# EAGLE design VehicleBattVMonIoT_SMD (EAGLE 7.5.0)
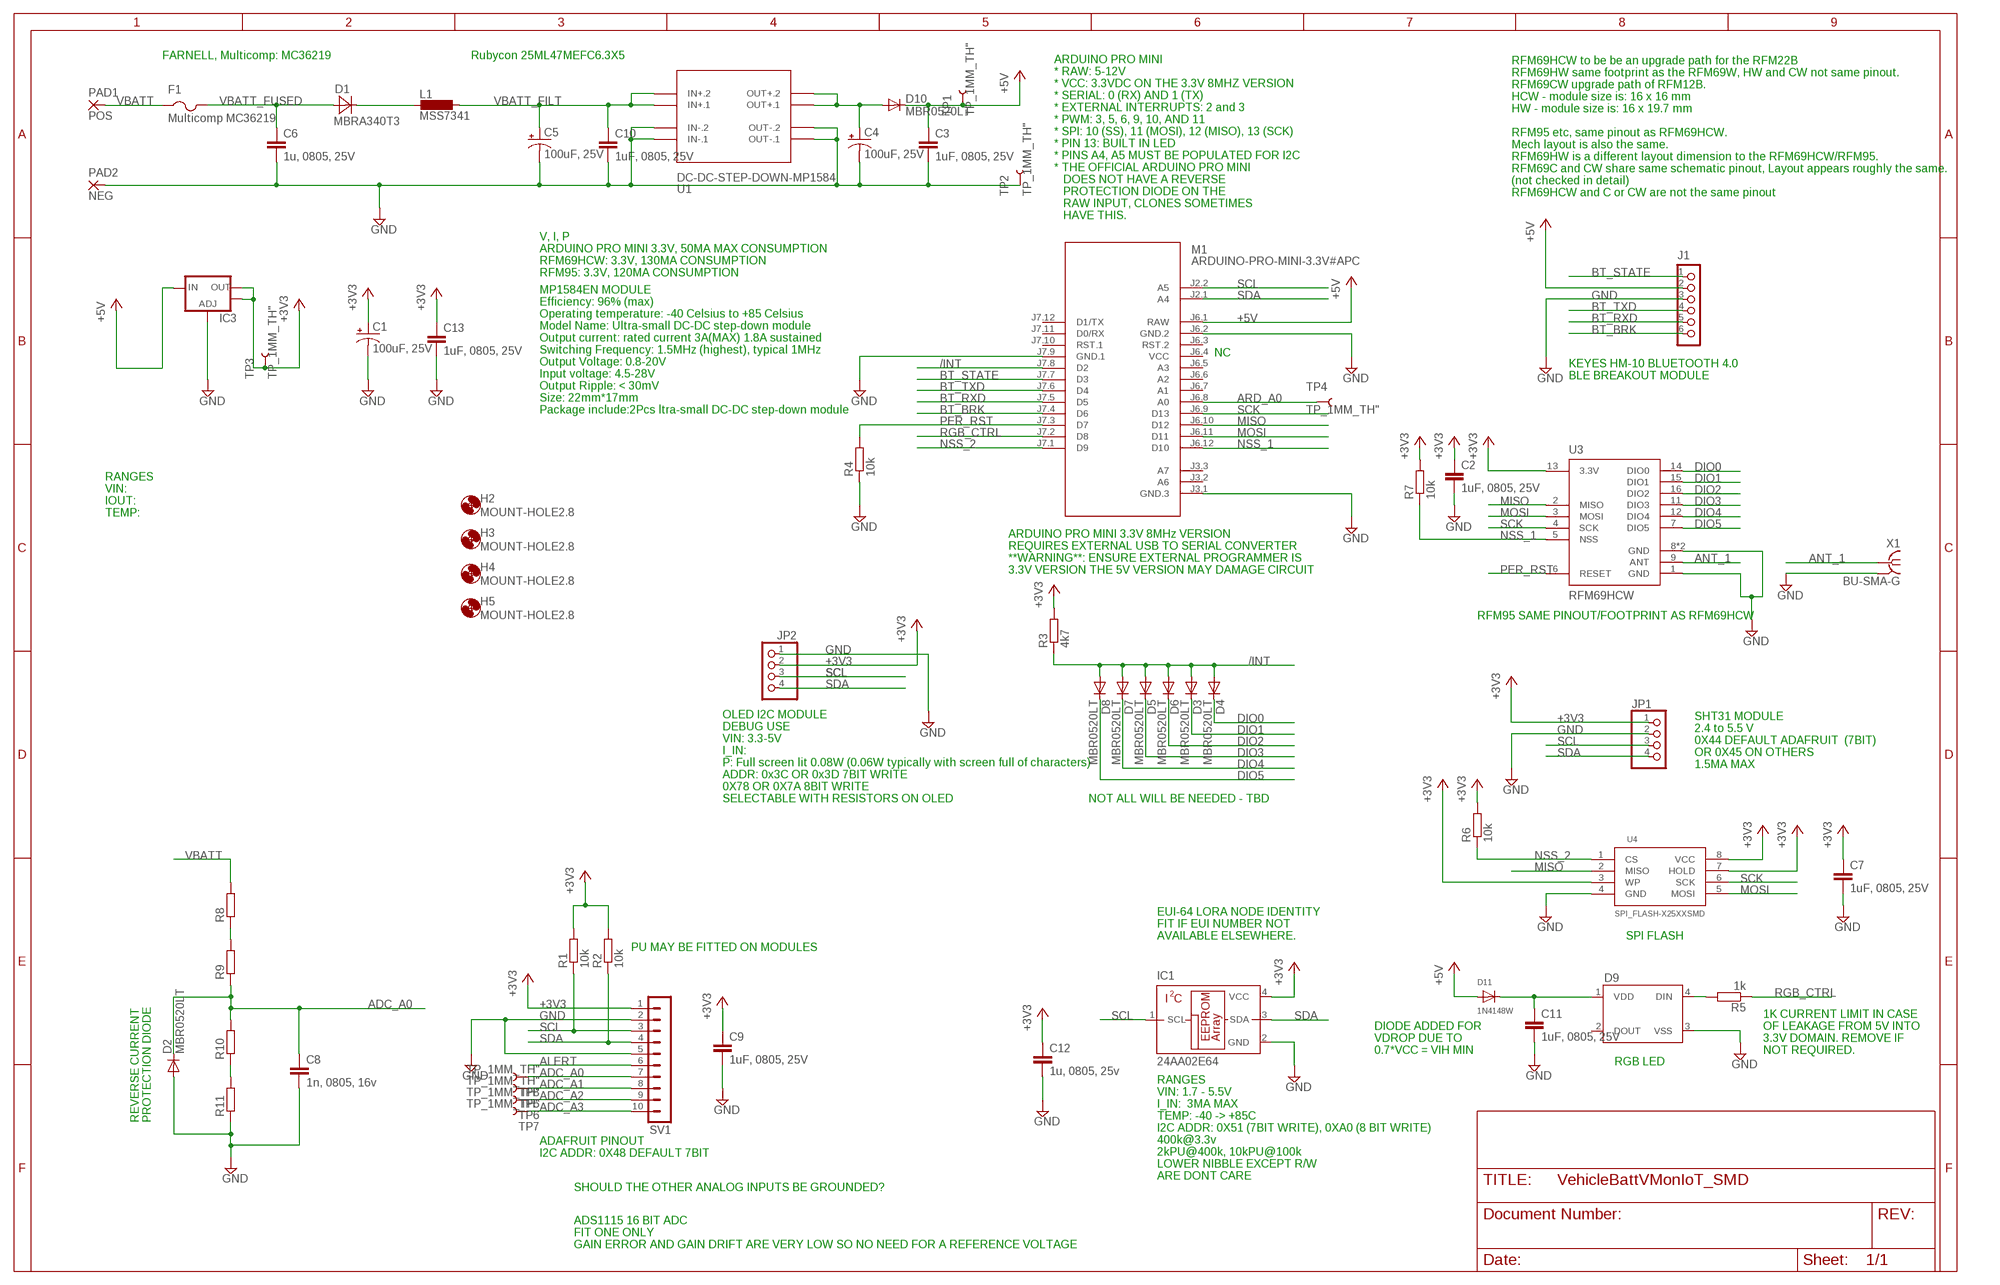
[diagram p0: schematic, sheet 1]

## Parts
C1  100uF, 25V  CAP_POLPTH1  [CPOL-RADIAL-100UF-25V]
C2  1uF, 0805, 25V  C-EUC0805  [C0805]
C3  1uF, 0805, 25V  C-EUC0805  [C0805]
C4  100uF, 25V  CAP_POLPTH1  [CPOL-RADIAL-100UF-25V]
C5  100uF, 25V  CAP_POLPTH1  [CPOL-RADIAL-100UF-25V]
C6  1u, 0805, 25V  C-EUC0805  [C0805]
C7  1uF, 0805, 25V  C-EUC0805  [C0805]
C8  1n, 0805, 16v  C-EUC0805  [C0805]
C9  1uF, 0805, 25V  C-EUC0805  [C0805]
C10  1uF, 0805, 25V  C-EUC0805  [C0805]
C11  1uF, 0805, 25V  C-EUC0805  [C0805]
C12  1u, 0805, 25v  C-EUC0805  [C0805]
C13  1uF, 0805, 25V  C-EUC0805  [C0805]
D1  MBRA340T3  [SMA]
D2  MBR0520LT  [SOD123]
D3  MBR0520LT  [SOD123]
D4  MBR0520LT  [SOD123]
D5  MBR0520LT  [SOD123]
D6  MBR0520LT  [SOD123]
D7  MBR0520LT  [SOD123]
D8  MBR0520LT  [SOD123]
D9  WS2812B  [WS2812B]
D10  MBR0520LT  [SOD123]
D11  1N4148W  DIODESOD-323F  [SOD-323F]
F1  Multicomp MC36219  PTCFUSE-1812  [1812]
H2  MOUNT-HOLE2.8  [2,8]
H3  MOUNT-HOLE2.8  [2,8]
H4  MOUNT-HOLE2.8  [2,8]
H5  MOUNT-HOLE2.8  [2,8]
IC1  24AA02E64  24AA00OT  [SOT23-5L]
IC3  V_REG_LM1117SOT223  [SOT223]
J1  CON_HEADER_1X06-SMD-RIGHT-ANGLED  [M1X6_MALE_RIGHT_ANGLED_SMD]
JP1  PINHD-1X4  [1X04]
JP2  PINHD-1X4  [1X04]
L1  MSS7341  [MSS7341]
M1  ARDUINO-PRO-MINI-3.3V#APC  [ARDUINO-PRO-MINI#APC]
PAD1  POS  3,81/1,4  [3,81/1,4]
PAD2  NEG  3,81/1,4  [3,81/1,4]
R1  10k  R-EU_R0805  [R0805]
R2  10k  R-EU_R0805  [R0805]
R3  4k7  R-EU_R0805  [R0805]
R4  10k  R-EU_R0805  [R0805]
R5  1k  R-EU_R0805  [R0805]
R6  10k  R-EU_R0805  [R0805]
R7  10k  R-EU_R0805  [R0805]
R8  R-EU_R0805  [R0805]
R9  R-EU_R0805  [R0805]
R10  R-EU_R0805  [R0805]
R11  R-EU_R0805  [R0805]
SV1  MA10-1W  [MA10-1W]
TP1  TP_1MM_TH"  [TP_1MM_TH]
TP2  TP_1MM_TH"  [TP_1MM_TH]
TP3  TP_1MM_TH"  [TP_1MM_TH]
TP4  TP_1MM_TH"  [TP_1MM_TH]
TP5  TP_1MM_TH"  [TP_1MM_TH]
TP6  TP_1MM_TH"  [TP_1MM_TH]
TP7  TP_1MM_TH"  [TP_1MM_TH]
TP8  TP_1MM_TH"  [TP_1MM_TH]
U1  DC-DC-STEP-DOWN-MP1584  [DC-DC-STEP-DOWN-MP1584]
U3  RFM69HCW  [RFM69HCW-XXXS2]
U4  SPI_FLASH-X25XXSMD  [SO08]
X1  BU-SMA-G  [BU-SMA-G]

## Nets
+3V3: C1.1(+) C2.1 C7.1 C9.1 C12.1 C13.1 IC1.4(VCC) IC3.2(OUT) IC3.4(OUT) JP1.1 JP2.2 R1.2 R2.2 R3.2 R6.2 R7.2 SV1.1 TP3.P$1 U3.13(3.3V) U4.3(WP) U4.7(HOLD) U4.8(VCC)
+5V: C3.1 D10.C D11.A IC3.3(IN) J1.2 M1.J6.1(RAW) TP1.P$1
/INT: D3.A D4.A D5.A D6.A D7.A D8.A M1.J7.8(D2) R3.1
ADC_A0: C8.1 D2.C R9.1 R10.2 SV1.7 TP8.P$1
ADC_A1: SV1.8 TP5.P$1
ADC_A2: SV1.9 TP6.P$1
ADC_A3: SV1.10 TP7.P$1
ALERT: SV1.6
ANT_1: U3.9(ANT) X1.1
ARD_A0: M1.J6.8(A0) TP4.P$1
BT_BRK: J1.6 M1.J7.4(D6)
BT_RXD: J1.5 M1.J7.5(D5)
BT_STATE: J1.1 M1.J7.7(D3)
BT_TXD: J1.4 M1.J7.6(D4)
DIO0: D4.C U3.14(DIO0)
DIO1: D3.C U3.15(DIO1)
DIO2: D6.C U3.16(DIO2)
DIO3: D5.C U3.11(DIO3)
DIO4: D7.C U3.12(DIO4)
DIO5: D8.C U3.7(DIO5)
GND: C1.2(-) C2.2 C3.2 C4.2(-) C5.2(-) C6.2 C7.2 C8.2 C9.2 C10.2 C11.2 C12.2 C13.2 D2.A D9.3(VSS) IC1.2(GND) IC3.1(ADJ) J1.3 JP1.2 JP2.1 M1.J3.1(GND.3) M1.J6.2(GND.2) M1.J7.9(GND.1) PAD2.1(P) R4.1 R11.1 SV1.2 SV1.5 TP2.P$1 U1.IN-.1 U1.IN-.2 U1.OUT-.1 U1.OUT-.2 U3.1(GND) U3.8(GND) U3.10(GND) U4.4(GND) X1.2 X1.3 X1.4 X1.5
MISO: M1.J6.10(D12) U3.2(MISO) U4.2(MISO)
MOSI: M1.J6.11(D11) U3.3(MOSI) U4.5(MOSI)
N$1: C11.1 D9.1(VDD) D11.C
N$2: D1.C L1.1
N$3: R10.1 R11.2
N$4: R8.1 R9.2
N$5: C4.1(+) D10.A U1.OUT+.1 U1.OUT+.2
N$6: D9.4(DIN) R5.2
NSS_1: M1.J6.12(D10) R7.1 U3.5(NSS)
NSS_2: M1.J7.1(D9) R6.1 U4.1(CS)
PER_RST: M1.J7.3(D7) R4.2 U3.6(RESET)
RGB_CTRL: M1.J7.2(D8) R5.1
SCK: M1.J6.9(D13) U3.4(SCK) U4.6(SCK)
SCL: IC1.1(SCL) JP1.3 JP2.3 M1.J2.2(A5) R1.1 SV1.3
SDA: IC1.3(SDA) JP1.4 JP2.4 M1.J2.1(A4) R2.1 SV1.4
VBATT: F1.1 PAD1.1(P) R8.2
VBATT_FILT: C5.1(+) C10.1 L1.2 U1.IN+.1 U1.IN+.2
VBATT_FUSED: C6.1 D1.A F1.2
Unconnected: D9.2(DOUT) M1.J3.2(A6) M1.J3.3(A7) M1.J6.3(RST.2) M1.J6.5(A3) M1.J6.6(A2) M1.J6.7(A1) M1.J7.10(RST.1) M1.J7.11(D0/RX) M1.J7.12(D1/TX)

## Notes on the sheet
- FARNELL, Multicomp: MC36219 | Rubycon 25ML47MEFC6.3X5
- RFM69HCW to be be an upgrade path for the RFM22B
  RFM69HW same footprint as the RFM69W, HW and CW not same pinout.
  RFM69CW upgrade path of RFM12B. 
  HCW - module size is: 16 x 16 mm 
  HW - module size is: 16 x 19.7 mm
  
  RFM95 etc, same pinout as RFM69HCW.
  Mech layout is also the same. 
  RFM69HW is a different layout dimension to the RFM69HCW/RFM95. 
  RFM69C and CW share same schematic pinout, Layout appears roughly the same. 
  (not checked in detail)
  RFM69HCW and C or CW are not the same pinout
- ARDUINO PRO MINI 
  * RAW: 5-12V
  * VCC: 3.3VDC ON THE 3.3V 8MHZ VERSION
  * SERIAL: 0 (RX) AND 1 (TX)
  * EXTERNAL INTERRUPTS: 2 and 3
  * PWM: 3, 5, 6, 9, 10, AND 11
  * SPI: 10 (SS), 11 (MOSI), 12 (MISO), 13 (SCK)
  * PIN 13: BUILT IN LED
  * PINS A4, A5 MUST BE POPULATED FOR I2C
  * THE OFFICIAL ARDUINO PRO MINI 
     DOES NOT HAVE A REVERSE
     PROTECTION DIODE ON THE 
     RAW INPUT, CLONES SOMETIMES 
     HAVE THIS.
- V, I, P
  ARDUINO PRO MINI 3.3V, 50MA MAX CONSUMPTION
  RFM69HCW: 3.3V, 130MA CONSUMPTION
  RFM95: 3.3V, 120MA CONSUMPTION
- NC
- KEYES HM-10 BLUETOOTH 4.0 
  BLE BREAKOUT MODULE
- MP1584EN MODULE
  Efficiency: 96% (max)
  Operating temperature: -40 Celsius to +85 Celsius
  Model Name: Ultra-small DC-DC step-down module
  Output current: rated current 3A(MAX) 1.8A sustained
  Switching Frequency: 1.5MHz (highest), typical 1MHz
  Output Voltage: 0.8-20V 
  Input voltage: 4.5-28V
  Output Ripple: < 30mV
  Size: 22mm*17mm
  Package include:2Pcs ltra-small DC-DC step-down module
- RANGES
  VIN: 
  IOUT:  
  TEMP:
- ARDUINO PRO MINI 3.3V 8MHz VERSION
  REQUIRES EXTERNAL USB TO SERIAL CONVERTER
  **WARNING**: ENSURE EXTERNAL PROGRAMMER IS 
  3.3V VERSION THE 5V VERSION MAY DAMAGE CIRCUIT
- RFM95 SAME PINOUT/FOOTPRINT AS RFM69HCW
- SHT31 MODULE
  2.4 to 5.5 V
  0X44 DEFAULT ADAFRUIT  (7BIT)
  OR 0X45 ON OTHERS
  1.5MA MAX
- OLED I2C MODULE
  DEBUG USE
  VIN: 3.3-5V
  I_IN:
  P: Full screen lit 0.08W (0.06W typically with screen full of characters)
  ADDR: 0x3C OR 0x3D 7BIT WRITE
  0X78 OR 0X7A 8BIT WRITE
  SELECTABLE WITH RESISTORS ON OLED
- NOT ALL WILL BE NEEDED - TBD
- EUI-64 LORA NODE IDENTITY
  FIT IF EUI NUMBER NOT 
  AVAILABLE ELSEWHERE.
- SPI FLASH
- PU MAY BE FITTED ON MODULES
- DIODE ADDED FOR 
  VDROP DUE TO 
  0.7*VCC = VIH MIN
- 1K CURRENT LIMIT IN CASE 
  OF LEAKAGE FROM 5V INTO
  3.3V DOMAIN. REMOVE IF 
  NOT REQUIRED.
- RGB LED
- REVERSE CURRENT 
  PROTECTION DIODE
- ADAFRUIT PINOUT
  I2C ADDR: 0X48 DEFAULT 7BIT
- RANGES
  VIN: 1.7 - 5.5V
  I_IN:  3MA MAX
  TEMP: -40 -> +85C
  I2C ADDR: 0X51 (7BIT WRITE), 0XA0 (8 BIT WRITE) 
  400k@3.3v
  2kPU@400k, 10kPU@100k
  LOWER NIBBLE EXCEPT R/W 
  ARE DONT CARE
- SHOULD THE OTHER ANALOG INPUTS BE GROUNDED?
- ADS1115 16 BIT ADC
  FIT ONE ONLY
  GAIN ERROR AND GAIN DRIFT ARE VERY LOW SO NO NEED FOR A REFERENCE VOLTAGE

## Power pins joined to a net without a drawn wire
VCC: M1.J6.4(VCC)

## Library data of the parts
C1 C4 C5 = SparkFun-Capacitors:CAP_POL: Capacitor Polarized These are standard SMD and PTH capacitors. Normally 10uF, 47uF, and 100uF in electrolytic and tantalum varieties. Always verify the external diameter of the through hole cap, it varies with capacity, voltage, and manufacturer. The EIA devices should be standard.
C2 C3 C6-C13 = rcl:C-EU: CAPACITOR, European symbol
D1 = diode:MBRA340T3: Surface Mount Schottky Power Rectifier Source: http://www.onsemi.com/pub_link/Collateral/MBRA340T3-D.PDF
D2-D8 D10 = diode:MBR0520LT: SCHOTTKY BARRIER RECTIFIER Source: http://onsemi.com .. MBR0520LT1-D.pdf
D9 = SparkFun-LED:WS2812B: WS2812B - Intelligent control LED integrated light source Technical Specifications: Power Supply Voltage (VDD): 3.5 to 5.3 V Input Voltage (VI): -0.5 to VDD+0.5 V Operating Junction Temperature (Topt): -25°C to +80°C Storage Temperature Range (Tstg): -55°C to +150°C
D11 = adafruit:DIODE: Diode SMADIODE - SMA Surface Mount Package 20V 1A Schottky Diode Digikey: 641-1014-6-ND DO-1N4148 - Through Hole Small Current Diode SOD-123 20V 1 A (.5mV Vf) Schottky Diode - Digikey: MBRX120TPMSCT-ND SOD-323 10V 570mA (.38mV Vf, 3ns) Schottky Diode - Digikey: ZLLS410CT-ND SOD-523 30V 30mA Schottky Diode (RB751S-40TE61) - Digikey: RB751S-40TE61CT-ND SOT23-R/W - SOT23 Package (R = Solder Paste/Reflow Ovens, W = Hand-Soldering) BAT54Film 40V 300mA - Digikey: 497-7162-1-ND
F1 = adafruit:PTCFUSE: PTC fuses, resettable thermistors
H2-H5 = holes:MOUNT-HOLE: MOUNTING HOLE with drill center marker
IC1 = microchip:24*00: Serial EEPROM 128 bit, I2C (AA = 1.8 V/LC = 2.5 V/C = 5.0 V); MF: MICROCHIP; MPN: 24AA00T-I/OTG; OC_FARNELL: 1331264; OC_NEWARK: 89H3038
IC3 = SparkFun-PowerIC:V_REG_LM1117: Voltage Regulator LM1117 Standard adjustable voltage regulator but in SMD form. Spark Fun Electronics SKU : COM-00595; PROD_ID: VREG-08170
J1 = dp_devices:CON_HEADER_1X06
JP1 JP2 = pinhead:PINHD-1X4: PIN HEADER
L1 = inductor-coilcraft:MSS7341: Shielded Power Inductors Package 6.6 × 6.6 mm x 4.1 mm high Source: http://www.farnell.com/datasheets/1681958.pdf
M1 = diy-modules:ARDUINO-PRO-MINI-*#APC: Arduino Pro Mini (and compatible devices) with angle programming connector More details available here: https://www.arduino.cc/en/Main/ArduinoBoardProMini Click here to find device on ebay.com <http://www.ebay.com/sch/arduino+pro+mini>
PAD1 PAD2 = wirepad:3,81/1,4: THROUGH-HOLE PAD
R1-R11 = rcl:R-EU_: RESISTOR, European symbol
SV1 = con-lstb:MA10-1W: PIN HEADER; OC_FARNELL: unknown; OC_NEWARK: unknown
TP1-TP8 = TP_1MM_TH:TP_1MM_TH: Bare copper test points for troubleshooting or ICT
U1 = diy-modules:DC-DC-STEP-DOWN-MP1584: DC/DC Step-Down Regulator based on MP1584 chip MP1584 datasheet available here: http://www.haoyuelectronics.com/Attachment/MP1584/MP1584.pdf Click here to find device on ebay.com <http://www.ebay.com/sch/mp1584+module>
U3 = SparkFun-RF:RFM69H
U4 = SparkFun-DigitalIC:SPI_FLASH-X25XX: 8pin SPI Flash series x25xx. Works with devices like W25X32 and BR25L32
X1 = con-coax:BU-SMA-G: FEMALE SMA CONNECTOR Radiall distributor RS 193-9117; OC_FARNELL: unknown; OC_NEWARK: unknown

## Board
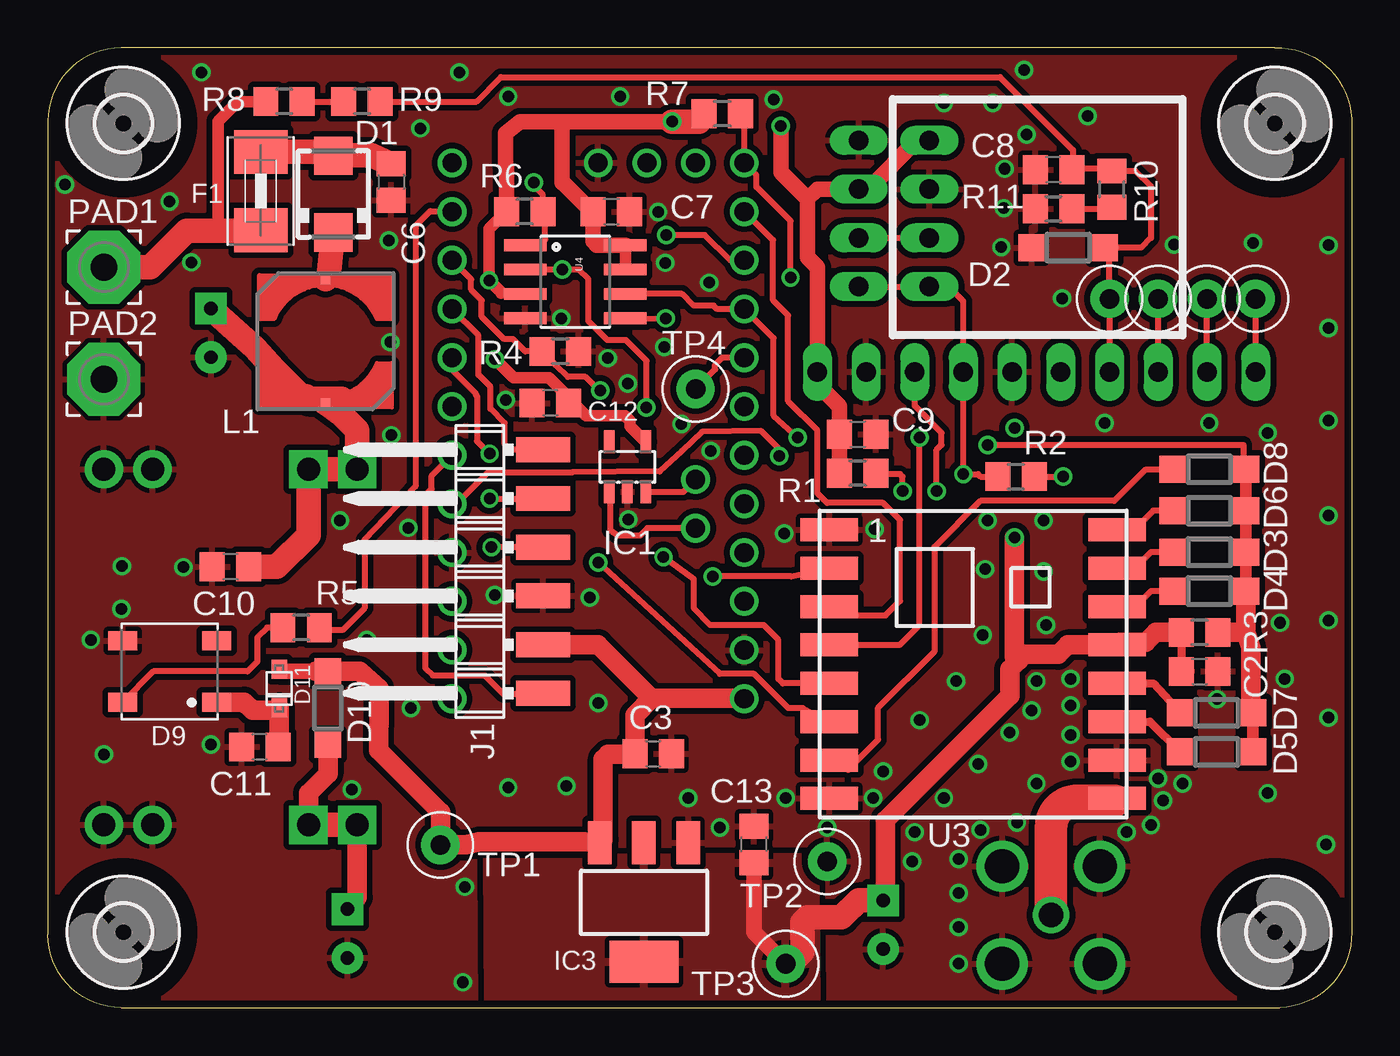
[diagram p1: board, top side]
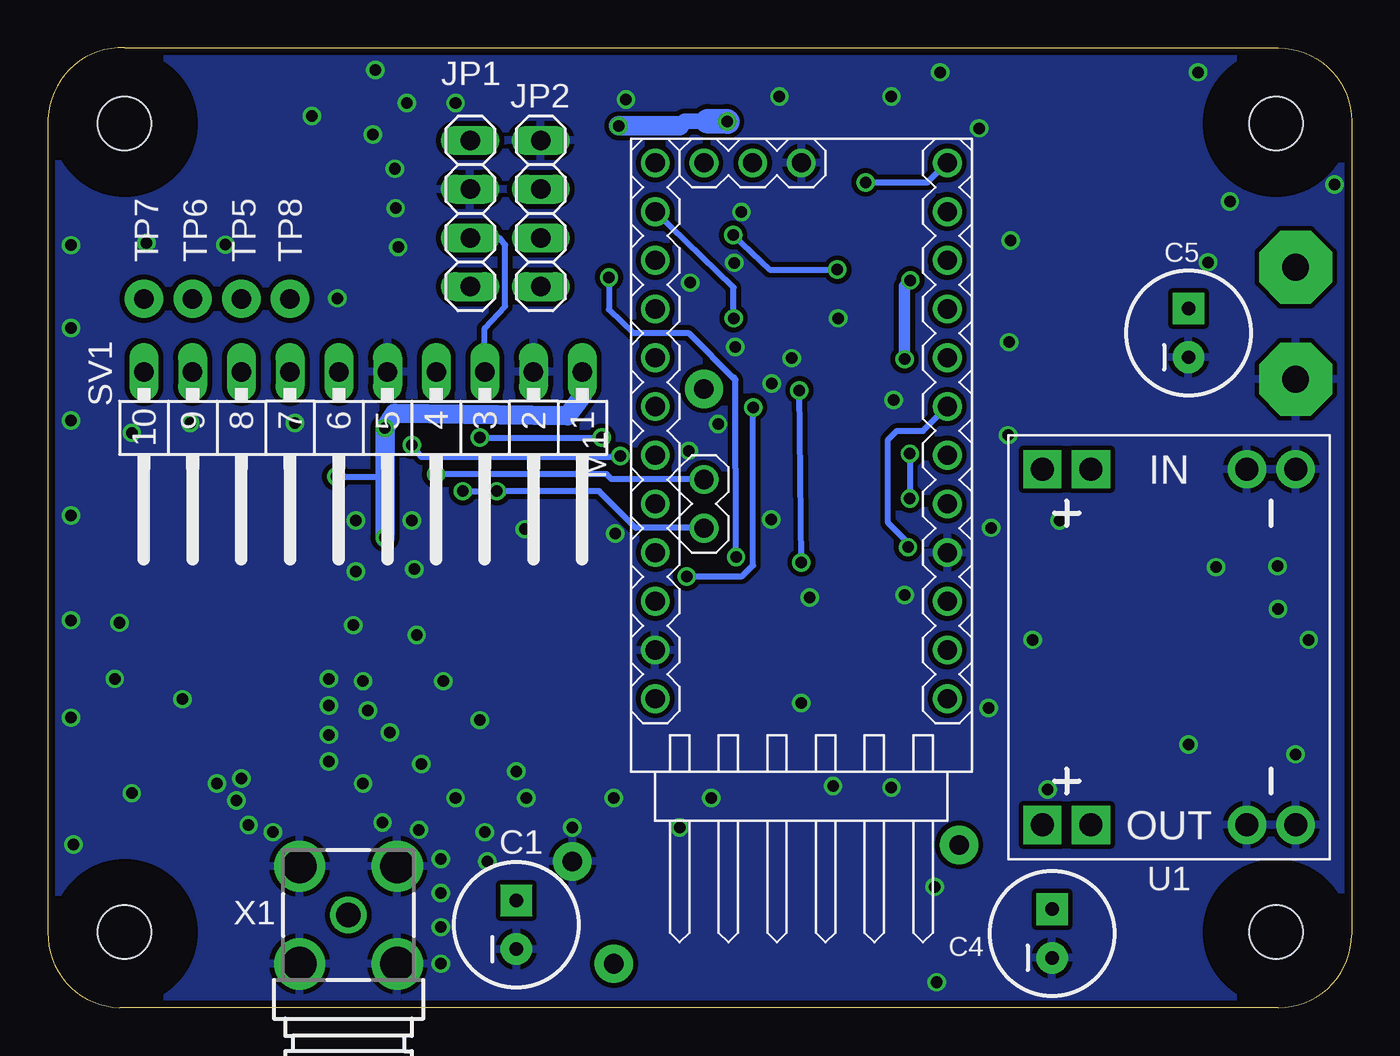
[diagram p2: board, bottom side, seen from below]

Size 68 x 50.04 mm. Coordinates in mm from the lower left corner, seen from the top.
Outline: 3.81,0 64.25,0 arc90 68,3.94 68,46.35 arc90 64,50.04 3.81,50.04 arc90 0,46.23 0,3.81 arc90 3.81,0
Copper layers (1*16): Top 0.0356mm / dielectric 1.5011mm / Bottom 0.0356mm
Design rules "oshpark-2layer": minimum track width 6mil, minimum drill 13mil, track to track 6mil, track to pad 6mil, pad to pad 6mil, via to via 6mil, smd to smd 6mil, copper to edge 15mil, drill to drill 6mil, minimum pad ring 7mil, minimum via ring 7mil, stop-mask expansion 2.5mil, vias tented up to drill 0mil, thermal gap 10mil

### Footprints (pad centres in the part's own frame; a part is rotated, then mirrored left to right if it is on the bottom)
CPOL-RADIAL-100UF-25V = drill 0.7 pad 1.651 square: 1 1.27,0 | drill 0.7 pad 1.651: 2 -1.27,0
C0805 = smd 1.3 x 1.5: 1 -0.95,0; 2 0.95,0
SMA = smd 2 x 2: A 2,0; C -2,0
SOD123 = smd 1.4 x 1.4: A 1.9,0; C -1.9,0
WS2812B = smd 1.5 x 1: 1 -2.45,1.6; 2 -2.45,-1.6; 3 2.45,-1.6; 4 2.45,1.6
SOD-323F = smd 1 x 0.8: A -1,0; C 1,0
1812 = smd 2.286 x 2.794: 1 -2.046,0; 2 2.046,0
2,8 = hole 2.8: 0,0
SOT23-5L = smd 0.55 x 1.2: 1 -0.95,-1.3; 2 0,-1.3; 3 0.95,-1.3; 4 0.95,1.3; 5 -0.95,1.3
SOT223 = smd 1.219 x 2.235: 1 -2.311,-3.099; 2 0,-3.099; 3 2.311,-3.099 | smd 3.6 x 2.2: 4 0,3.099
M1X6_MALE_RIGHT_ANGLED_SMD = smd 1.3 x 2.8: 1 -6.35,-3.3; 2 -3.81,-3.3; 3 -1.27,-3.3; 4 1.27,-3.3; 5 3.81,-3.3; 6 6.35,-3.3
1X04 = drill 1.016 long: 1 -3.81,0; 2 -1.27,0; 3 1.27,0; 4 3.81,0
MSS7341 = smd 0.5 x 0.5: 1 0,3.225; 2 0,-3.225
ARDUINO-PRO-MINI#APC = drill 1: J2.1 -1.27,5.08; J2.2 -3.81,5.08; J3.1 15.24,0; J3.2 15.24,2.54; J3.3 15.24,5.08; J6.1 -12.7,7.62; J6.2 -10.16,7.62; J6.3 -7.62,7.62; J6.4 -5.08,7.62; J6.5 -2.54,7.62; J6.6 0,7.62; J6.7 2.54,7.62; J6.8 5.08,7.62; J6.9 7.62,7.62; J6.10 10.16,7.62; J6.11 12.7,7.62; J6.12 15.24,7.62; J7.1 15.24,-7.62; J7.2 12.7,-7.62; J7.3 10.16,-7.62; J7.4 7.62,-7.62; J7.5 5.08,-7.62; J7.6 2.54,-7.62; J7.7 0,-7.62; J7.8 -2.54,-7.62; J7.9 -5.08,-7.62; J7.10 -7.62,-7.62; J7.11 -10.16,-7.62; J7.12 -12.7,-7.62
3,81/1,4 = drill 1.397 pad 3.81 octagon: 1 0,0
R0805 = smd 1.3 x 1.5: 1 -0.95,0; 2 0.95,0
MA10-1W = drill 1.016 long: 1 -11.43,0; 2 -8.89,0; 3 -6.35,0; 4 -3.81,0; 5 -1.27,0; 6 1.27,0; 7 3.81,0; 8 6.35,0; 9 8.89,0; 10 11.43,0
TP_1MM_TH = drill 1.02 pad 2: P$1 0,0
DC-DC-STEP-DOWN-MP1584 = drill 1.2 pad 2 square: IN+.1 -9.271,-4.064; IN+.2 -9.271,-6.604; OUT+.1 9.271,-4.064; OUT+.2 9.271,-6.604 | drill 1.2 pad 2: IN-.1 -9.271,6.604; IN-.2 -9.271,4.064; OUT-.1 9.271,6.604; OUT-.2 9.271,4.064
RFM69HCW-XXXS2 = smd 3 x 1.2: 1 -7.5,7; 2 -7.5,5; 3 -7.5,3; 4 -7.5,1; 5 -7.5,-1; 6 -7.5,-3; 7 -7.5,-5; 8 -7.5,-7; 9 7.5,-7; 10 7.5,-5; 11 7.5,-3; 12 7.5,-1; 13 7.5,1; 14 7.5,3; 15 7.5,5; 16 7.5,7
SO08 = smd 0.61 x 2.21: 1 -1.905,-2.616; 2 -0.635,-2.616; 3 0.635,-2.616; 4 1.905,-2.616; 5 1.905,2.616; 6 0.635,2.616; 7 -0.635,2.616; 8 -1.905,2.616
BU-SMA-G = drill 1.27: 1 0,0 | drill 1.778: 2 -2.55,2.55; 3 2.55,2.55; 4 2.55,-2.55; 5 -2.55,-2.55

### Placement (x,y rotation side)
C1  43.56,4.32 90 bottom
C2  60.07,17.53 0 top
C3  31.57,13.23 0 top
C4  15.62,3.86 90 bottom
C5  8.51,35.18 90 bottom
C6  17.91,43.05 270 top
C7  29.39,41.5 0 top
C8  52.45,43.69 180 top
C9  42.24,29.9 0 top
C10  9.53,22.99 180 top
C11  11.05,13.59 180 top
C12  26.21,31.52 180 top
C13  36.83,8.51 90 top
D1  14.88,42.42 90 top
D2  53.21,39.62 180 top
D3  60.58,23.75 0 top
D4  60.58,21.72 0 top
D5  60.96,13.34 0 top
D6  60.58,25.91 0 top
D7  60.96,15.37 0 top
D8  60.58,28.07 0 top
D9  6.35,17.53 180 top
D10  14.61,15.62 270 top
D11  12.06,16.64 270 top
F1  11.1,42.57 90 top
H2  3.94,3.94 0 top
H3  3.94,46.1 0 top
H4  64,46.1 0 top
H5  64,3.94 0 top
IC1  30.23,28.19 0 top
IC3  31.09,5.49 180 top
J1  22.53,22.73 90 top
JP1  45.97,41.4 270 bottom
JP2  42.29,41.4 270 bottom
L1  14.48,34.75 0 top
M1  28.7,28.8 90 bottom
PAD1  2.92,38.61 0 top
PAD2  2.92,32.77 0 top
R1  42.24,27.86 180 top
R2  50.5,27.69 0 top
R3  60.07,19.56 180 top
R4  26.72,34.21 180 top
R5  13.21,19.81 180 top
R6  24.87,41.5 180 top
R7  35.18,46.61 180 top
R8  12.32,47.24 180 top
R9  16.38,47.24 180 top
R10  55.5,42.67 90 top
R11  52.45,41.66 0 top
SV1  51.56,33.15 180 bottom
TP1  20.47,8.48 0 top
TP2  40.64,7.62 0 top
TP3  38.48,2.29 0 top
TP4  33.78,32.26 0 top
TP5  57.91,36.96 0 top
TP6  60.45,36.96 0 top
TP7  62.99,36.96 0 top
TP8  55.37,36.96 0 top
U1  9.53,18.8 270 bottom
U3  48.26,17.91 0 top
U4  27.51,37.85 270 top
X1  52.32,4.83 270 bottom

### Tracks (layer width: path | path; a pad name or v marks a point on that pad's centre or on a via)
+3V3  (via drill 0.6)
  Top 0.305: R2.2 v52.96,27.69 | U4.3 23.65,37.24 | 41.44,29.9 C9.1
  Top 0.406: R3.2 C2.1
  Top 0.61: U4.7 U4.8 | R6.2 23.01,40.6 v23.01,37.92 23.65,37.29 23.65,37.24 | v23.32,33.81 24.28,32.84 26.14,32.84 27.16,31.82 C12.1 27.41,31.52 28.07,30.86 30.1,30.86 30.35,30.61 30.35,30.32 IC1.4
  Top 0.813: R6.2 23.92,43.85 23.88,43.99 23.88,45.59 24.64,46.2 27.03,46.2 | U4.8 28.63,39.75 28.42,39.95 28.42,41.49 | 28.37,41.5 26.87,43 26.82,43 26.82,46 27.03,46.2 | 27.03,46.2 v32.56,46.2 | C13.1 36.83,3.94 TP3.P$1 | v38.23,45.97 38.23,43.56 39.62,42.16 | 39.62,42.16 39.62,39.12 40.13,38.61 SV1.1 40.13,32.51 41.28,31.36 41.28,30.87 41.29,30.86 C9.1 R1.2 | 39.62,42.16 40.13,42.67 JP2.2 42.8,42.67 45.34,45.21 JP1.1
  Top 1.016: C1.1 43.69,5.71 43.69,9.78 50.16,16.26 50.16,17.65 50.61,18.1 | 50.8,18.29 50.42,17.93 | 50.61,18.1 50.8,18.29 | 50.8,18.29 50.93,18.41 52.7,18.41 53.2,18.91 U3.13 55.9,19.05 57.28,19.05 57.78,19.56 R3.2 | 28.42,41.49 C7.1 28.37,41.5 | v50.42,24.51 50.42,18.29 50.61,18.1
  Top 1.27: C2.1 59.18,17.53 | C1.1 42.29,5.59 41.4,4.7 39.62,4.7 39.37,4.45 39.37,2.92 38.63,2.18 | v32.56,46.2 33.95,46.2 R7.2
  Bottom 0.305: 39.62,32.64 SV1.1 | v52.96,27.69 50.42,27.69
  Bottom 0.61: v23.32,33.81 23.32,37.61 23.24,37.69 23.24,37.7 v23.01,37.92
  Bottom 0.813: 33.59,46.23 34.8,46.23 35.05,45.97
  Bottom 1.016: SV1.1 40.13,31.88 40.89,30.86 49.91,30.99 v50.42,30.23 50.42,27.69 v50.42,24.51 | v38.23,45.97 35.05,45.97
  Bottom 1.27: 33.59,46.23 32.59,46.23 v32.56,46.2
  pour Top (isolate 0.305): 22.89,7.8 22.94,0.13 40.11,0.3 40.03,7.87
+5V
  Top 0.813: 13.96,17.53 12.18,17.53 D11.A
  Top 1.016: D10.C 16.26,17.53 17.27,16.64 17.27,14.73 17.25,14.71 17.25,13.41 20.47,10.19 TP1.P$1 21.82,8.48 22.48,8.64 27.96,8.64 IC3.3 28.96,8.76 28.96,12.95 29.21,13.21 30.6,13.21 C3.1 30.62,15.26 31.5,16.13 | D10.C | D10.C 13.96,17.53 | 31.5,16.13 36.3,16.13 M1.J6.1 | J1.2 28.7,18.92 31.5,16.13
/INT  (via drill 0.6)
  Top 0.305: v49.02,29.34 62.36,29.34 62.36,27.05 D8.A | M1.J7.8 21.11,26.29 21.34,26.29 22.96,27.91 27.38,27.91 31.9,27.96 33.07,29.03 34.11,30.02 37.19,30.07 38.15,29.11 v38.15,28.75
  Top 0.61: D4.A D3.A D6.A D8.A | D7.A D5.A
  Top 1.016: D4.A 62.48,21.46 62.48,19.56 | D7.A 62.74,15.12 62.74,18.8 62.48,19.56 | R3.1 62.48,19.56
  Bottom 0.305: v49.02,29.34 48.51,28.7 38.2,28.7 v38.15,28.75
ADC_A0
  Top 0.305: R10.2 56.71,43.65 57.53,42.82 57.53,40.13 57.02,39.62 D2.C 55.37,39.37 TP8.P$1 SV1.7 | 55.43,43.69 R10.2 | R9.1 22.35,47.24 23.62,48.51 49.66,48.51 53.47,44.7 53.47,43.75 | 53.47,43.75 C8.1 | 53.47,43.75 55.37,43.75 R10.2
ADC_A1
  Top 0.305: SV1.8 TP5.P$1
ADC_A2
  Top 0.305: SV1.9 TP6.P$1
ADC_A3
  Top 0.305: SV1.10 TP7.P$1
ANT_1
  Top 0.305: U3.9 55.65,10.79
  Top 1.7: X1.1 52.32,9.4 arc-90 53.72,10.79 55.65,10.79
ARD_A0
  Top 0.305: TP4.P$1 34.8,33.27 34.8,33.53 35.18,33.91 36.3,33.91 M1.J6.8
BT_BRK
  Top 0.305: J1.6 24.11,29.08 23.82,29.36 23.82,30.48 23.09,31.22 23.09,32.36 22.45,32.99 22.45,35.05 M1.J7.4
BT_RXD  (via drill 0.6)
  Top 0.305: M1.J7.5 21.08,33.25 22.33,32 22.33,31.95 22.38,31.9 22.38,29.54 v23.04,28.88 | v23.04,26.54 J1.5
  Bottom 0.305: v23.04,28.88 v23.04,26.54
BT_STATE
  Top 0.305: M1.J7.7 20.02,27.74 20.02,27.05 19.68,26.72 19.68,17.7 20.07,17.32 22.78,17.32 23.75,16.36 25.8,16.36 J1.1
BT_TXD  (via drill 0.6)
  Top 0.305: J1.4 v23.14,24
  Bottom 0.305: v23.14,24 23.14,24.23 24.18,25.27 24.18,29.62 23.72,30.07 22.35,30.07 M1.J7.6
DIO0
  Top 0.305: D4.C 57.53,21.72 56.77,20.95 55.81,20.95 U3.14
DIO1
  Top 0.305: D3.C 57.53,23.75 56.77,22.99 55.84,22.99 U3.15
DIO2
  Top 0.305: D6.C 57.66,25.91 56.64,24.89 55.77,24.89 U3.16
DIO3
  Top 0.406: U3.11 57.49,14.91 D5.C
DIO4
  Top 0.406: U3.12 57.65,16.91 D7.C
DIO5
  Top 0.305: U3.7 41.74,12.4 43.31,13.97 43.31,15.62 46.23,18.54 46.23,24 48.64,26.42 55.63,26.42 57.28,28.07 D8.C
GND  (via drill 0.6)
  Top 0.813: C13.2 37.02,9.46
  other vias: 55.12,30.48 58.17,10.79 53.34,12.83 38.4,24.71 43.13,24.94 38.48,10.92 33.4,10.92 40.64,9.4 62.87,39.88 54.23,46.48 49.28,47.17 46.74,47.17 49.86,41.68 24,47.5 0.89,42.93 60.58,30.48 51.56,11.68 50.55,9.65 57.91,11.94 53.34,14.22 59.18,11.68 56.26,9.14 57.53,9.53 53.34,17.14 51.56,17.02 45.21,9.14 45.09,7.62 43.05,10.92 47.37,17.02 49.02,25.4 51.94,25.4 52.07,19.94 48.77,19.43 48.9,22.86 51.94,22.73 45.47,14.99 48.51,12.7 8,48.77 19.43,45.85 50.93,48.9 60.99,16.08 7.49,38.86 15.85,11.38 18.8,25.02 17.78,40.01 21.74,6.3 21.64,1.32 29.84,47.5 43.56,12.32 35.05,9.4 63.63,11.18 27.05,11.56 28.7,15.88 6.35,42.04 18.92,15.62 17.91,29.84 7.06,22.96 15.24,25.4 16.64,19.18 3.86,23.01 2.92,13.21 8.51,13.72 26.77,35.94 31.83,41.48 29.21,33.86 37.85,47.35 33.05,30.43 34.57,29.03 32.16,34.44 34.49,37.8 32.21,38.84 24,11.48 3.84,20.78 2.24,19.18 17.86,34.7 30.25,32.54 30.28,25.45 23.88,31.67 28.27,21.39 64.26,20.07 23.32,21.51 21.46,48.77 49.91,43.74 51.05,45.52 50.16,14.35 51.31,15.49 46.74,10.92 53.34,15.75 48.64,9.27 47.5,5.97 47.5,4.19 47.5,2.29 47.5,7.75 49.73,39.65 58.75,39.78 63.63,29.97 64.52,17.14 66.8,39.75 66.8,30.61 66.8,20.19 66.67,8.51 66.8,15.11 66.8,25.65 66.8,35.43 52.91,36.98
  pour Top (isolate 0.305, rank 6): -5,60 70,60 70,-5 -5,-5
  pour Bottom (isolate 0.254, rank 6): -5,60 -5.46,-4.57 70,-5 70,60
MISO  (via drill 0.6)
  Top 0.305: U3.2 38.77,22.48 v34.67,22.48 | v32.26,40.28 34.27,40.28 35.59,38.99 35.61,38.96 M1.J6.10 | U4.2 v26.82,38.48 27.71,38.48 28.19,38 28.19,35.79 29.18,34.8 30.15,34.8 31.24,33.71 31.22,33.68 v31.22,31.29
  Bottom 0.305: v34.67,22.48 31.8,22.48 31.22,23.06 v31.22,31.29 | v32.26,40.28 30.35,38.48 v26.82,38.48
MOSI  (via drill 0.6)
  Top 0.305: U3.3 40.81,20.45 43.69,20.45 44.45,21.21 44.45,25.43 43.56,26.31 40.64,26.31 40.13,26.82 40.13,30.1 38.61,31.62 38.61,36.09 37.82,36.88 37.82,40.03 37.8,40.03 M1.J6.11 | U4.5 30.91,35.92 v32.23,35.94
  Bottom 0.305: M1.J6.11 32.31,37.62 32.23,37.54 v32.23,35.94
N$1
  Top 1.016: D9.1 10.24,15.93 10.67,15.49 11.92,15.49 D11.C 12.06,13.65 C11.1
N$2
  Top 1.27: D1.C 14.63,38.12 L1.1
N$3
  Top 0.305: R11.2 55.43,41.66 R10.1
N$4
  Top 0.305: R8.1 R9.2
N$5
  Top 1.016: D10.A 14.61,12.19 13.59,11.18 U1.OUT+.1 | C4.1 16.13,5.74 U1.OUT+.2
  Top 1.27: U1.OUT+.1 U1.OUT+.2
N$6
  Top 0.305: R5.2 11.43,19.81 10.92,19.3 10.92,18.03 10.41,17.53 5.5,17.53 D9.4
NSS_1  (via drill 0.6)
  Top 0.305: U3.5 38.34,16.91 38.1,17.14 38.1,19.18 37.34,19.94 34.54,19.94 33.68,20.83 33.68,22.35 v32.11,23.5 | R7.1 36.32,46.29 M1.J6.12 36.96,43.41 36.96,42.8 38.73,41.02 v38.73,38.08
  Bottom 0.305: v38.73,38.08 38.73,36.4 37.49,35.18 34.59,35.18 32.13,32.72 | 32.21,32.84 32.13,32.72 | v32.11,23.5 32.13,32.72
NSS_2  (via drill 0.6)
  Top 0.305: U4.1 25.63,39.75 25.93,40.06 25.93,41.39 R6.1 25.82,42.38 25.35,42.85 v25.35,43.03
  Bottom 0.305: v25.35,43.03 22.12,43.03 21.11,44.04 M1.J7.1
PER_RST  (via drill 0.6)
  Top 0.305: U3.6 40.71,14.86 39.37,15.62 38.61,15.62 36.83,17.4 35.05,17.4 v28.7,23.22 | M1.J7.3 22.07,37.97 22.07,37.44 22.63,36.88 22.63,36.02 23.8,34.85 24.26,34.85 24.89,34.21 R4.2 26.47,33.52 27.13,32.89 28.04,32.89 28.73,32.21 v28.8,32.18
  Bottom 0.305: v28.7,23.22 v28.8,32.18
RGB_CTRL
  Top 0.305: R5.1 14.29,19.68 15.37,19.68 16.51,20.83 16.51,24.38 19.18,27.18 19.18,40.77 19.94,41.53 19.96,41.5 M1.J7.2
SCK  (via drill 0.6)
  Top 0.305: U3.4 44.43,18.91 45.47,19.94 v45.47,29.72 | v39.12,29.72 37.85,30.86 37.85,34.92 37.82,34.92 M1.J6.9 34.9,36.42 34.72,36.6 33.68,36.6 33.07,37.21 U4.6
  Bottom 0.305: v45.47,29.72 v39.12,29.72
SCL  (via drill 0.6)
  Top 0.305: v46.35,26.92 46.35,29.08 46.61,29.34 46.61,29.97 45.21,31.37 SV1.3 | M1.J2.2 31.27,24.99 30.89,24.61 29.74,24.61 29.34,24.89 29.34,26.83 IC1.1 | 43.19,27.68 R1.1 43.24,27.81 44.45,27.81 44.58,27.69 v44.58,26.92 | JP2.3 JP1.3
  Bottom 0.305: M1.J2.2 33.81,25.02 37.34,25.02 39.24,26.92 v44.58,26.92 v46.35,26.92 | SV1.3 45.21,35.43 44.15,36.58 44.15,39.75 44.45,40.13 JP1.3
SDA  (via drill 0.6)
  Top 0.305: 33.78,27.51 M1.J2.1 33.14,26.89 IC1.3 | R2.1 48.64,27.69 48.51,27.81 v47.75,27.81 SV1.4 47.75,36.83 46.99,37.59 JP1.4 JP2.4
  Bottom 0.305: v47.75,27.81 38.86,27.81 38.61,27.56 33.81,27.56 M1.J2.1
VBATT
  Top 0.61: R8.2 9.91,47.24 8.89,46.23 8.89,40.77 8.38,40.51
  Top 1.27: PAD1.1 5.33,38.61 7.24,40.51 8.38,40.51 10.83,40.51 F1.1
VBATT_FILT
  Top 1.27: C5.1 10.79,34.42 11.81,33.27 13.21,31.88 13.46,31.88 13.59,31.75 15.32,31.75 L1.2 15.37,30.86 16.13,30.1 U1.IN+.2 U1.IN+.1 13.59,24.64 11.94,22.99 C10.1
VBATT_FUSED
  Top 1.27: F1.2 14.43,44.62 D1.A 14.66,44.45 16.89,44.45 17.85,44 C6.1